# EAGLE design LPEM (EAGLE 6.5.0)

## Sheet 1 of 2
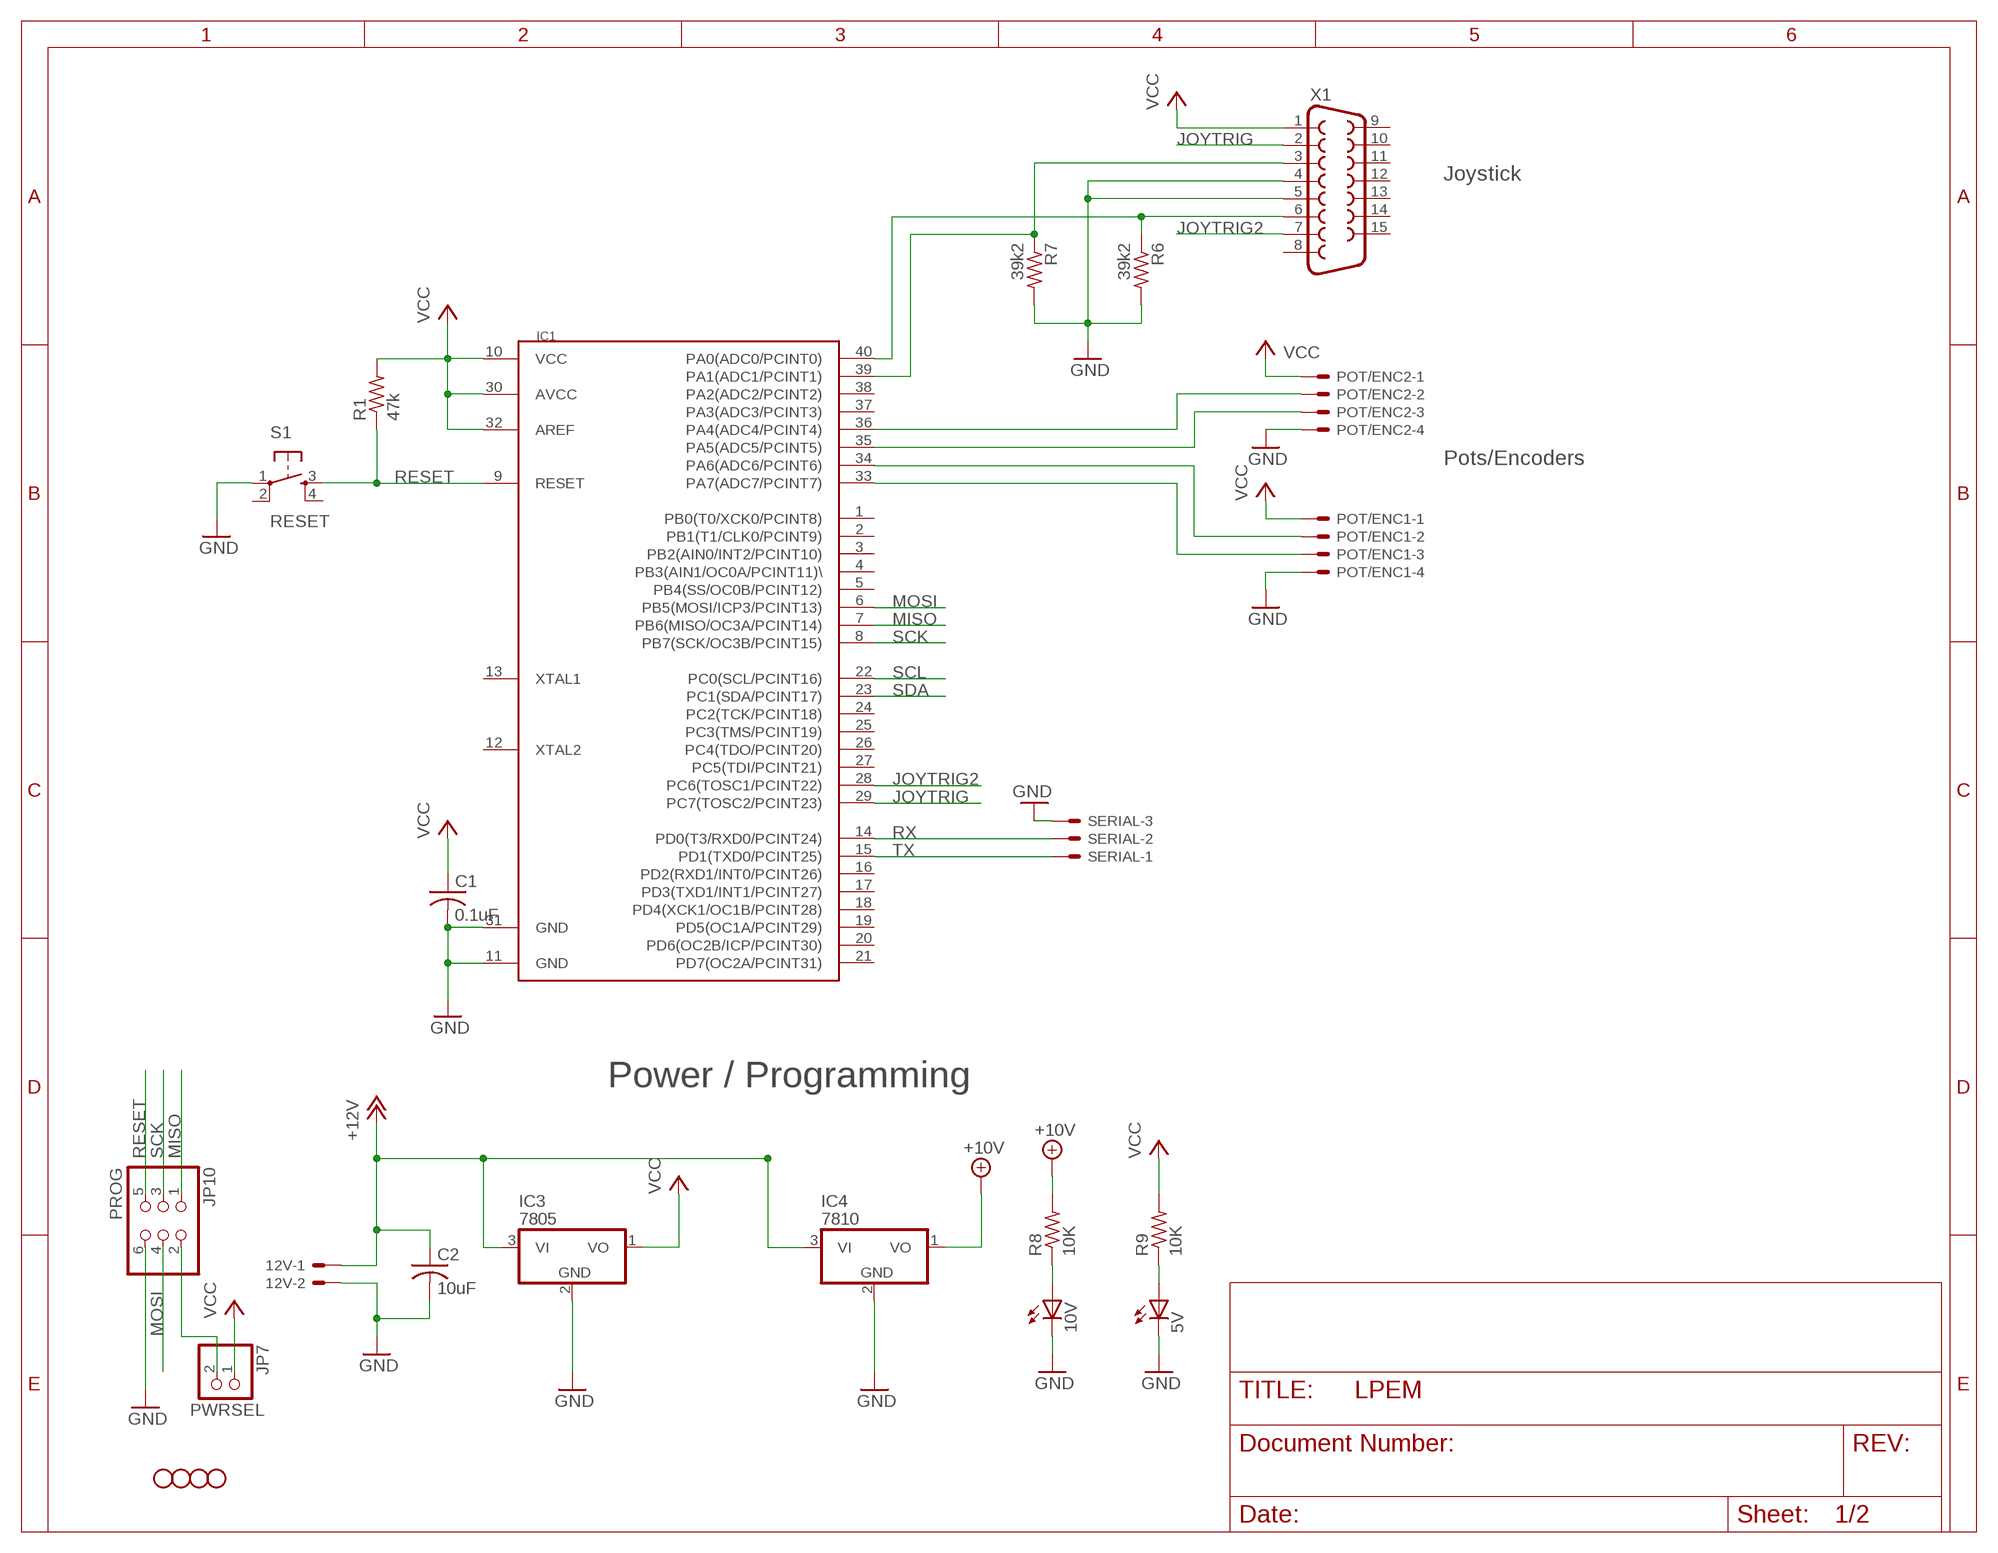
[diagram p0: schematic, sheet 1]

### Parts
5V  LED3MM  [LED3MM]
10V  LED3MM  [LED3MM]
12V  22-23-2021  [22-23-2021]
C1  0.1uF  C-US025-025X050  [C025-025X050]
C2  10uF  C-US025-025X050  [C025-025X050]
IC1  MEGA1284P  [DIL40]
IC3  7805  78L05Z  [TO92]
IC4  7810  78L05Z  [TO92]
JP1  STAND-OFF  [STAND-OFF]
JP2  STAND-OFF  [STAND-OFF]
JP7  PWRSEL  PINHD-1X2  [1X02]
JP8  STAND-OFF  [STAND-OFF]
JP9  STAND-OFF  [STAND-OFF]
JP10  PROG  PINHD-2X3  [2X03]
POT/ENC1  22-23-2041  [22-23-2041]
POT/ENC2  22-23-2041  [22-23-2041]
R1  47k  R-US_0204/5  [0204/5]
R6  39k2  R-US_0204/5  [0204/5]
R7  39k2  R-US_0204/5  [0204/5]
R8  10K  R-US_0204/5  [0204/5]
R9  10K  R-US_0204/5  [0204/5]
S1  RESET  TAC_SWITCHPTH  [TACTILE-PTH]
SERIAL  22-23-2031  [22-23-2031]
X1  F15HP  [F15HP]

### Nets
+10V [power]: IC4.1(VO) R8.2 ; also sheet 2
+12V [power]: 12V.1 C2.1 IC3.3(VI) IC4.3(VI) ; also sheet 2
GND [power]: 5V.K(C) 10V.K(C) 12V.2 C1.2 C2.2 IC1.11(GND) IC1.31(GND) IC3.2(GND) IC4.2(GND) JP10.6 POT/ENC1.4 POT/ENC2.4 R6.2 R7.2 S1.1 SERIAL.3 X1.4 X1.5 ; also sheet 2
JOYTRIG: IC1.29(PC7(TOSC2/PCINT23)) X1.2
JOYTRIG2: IC1.28(PC6(TOSC1/PCINT22)) X1.7
MISO: IC1.7(PB6(MISO/OC3A/PCINT14)) JP10.1
MOSI: IC1.6(PB5(MOSI/ICP3/PCINT13)) JP10.4
N$1: IC1.35(PA5(ADC5/PCINT5)) POT/ENC2.3
N$2: IC1.36(PA4(ADC4/PCINT4)) POT/ENC2.2
N$3: IC1.39(PA1(ADC1/PCINT1)) R7.1 X1.3
N$4: JP7.2 JP10.2
N$5: 5V.A R9.1
N$6: IC1.40(PA0(ADC0/PCINT0)) R6.1 X1.6
N$7: 10V.A R8.1
N$8: IC1.34(PA6(ADC6/PCINT6)) POT/ENC1.2
N$9: IC1.33(PA7(ADC7/PCINT7)) POT/ENC1.3
RESET: IC1.9(RESET) JP10.5 R1.1 S1.3
RX: IC1.14(PD0(T3/RXD0/PCINT24)) SERIAL.2
SCK: IC1.8(PB7(SCK/OC3B/PCINT15)) JP10.3
SCL: IC1.22(PC0(SCL/PCINT16)) ; also sheet 2
SDA: IC1.23(PC1(SDA/PCINT17)) ; also sheet 2
TX: IC1.15(PD1(TXD0/PCINT25)) SERIAL.1
VCC [power]: C1.1 IC1.10(VCC) IC1.30(AVCC) IC1.32(AREF) IC3.1(VO) JP7.1 POT/ENC1.1 POT/ENC2.1 R1.2 R9.2 X1.1 ; also sheet 2
Unconnected: IC1.1(PB0(T0/XCK0/PCINT8)) IC1.2(PB1(T1/CLK0/PCINT9)) IC1.3(PB2(AIN0/INT2/PCINT10)) IC1.4(PB3(AIN1/OC0A/PCINT11)\) IC1.5(PB4(SS/OC0B/PCINT12)) IC1.12(XTAL2) IC1.13(XTAL1) IC1.16(PD2(RXD1/INT0/PCINT26)) IC1.17(PD3(TXD1/INT1/PCINT27)) IC1.18(PD4(XCK1/OC1B/PCINT28)) IC1.19(PD5(OC1A/PCINT29)) IC1.20(PD6(OC2B/ICP/PCINT30)) IC1.21(PD7(OC2A/PCINT31)) IC1.24(PC2(TCK/PCINT18)) IC1.25(PC3(TMS/PCINT19)) IC1.26(PC4(TDO/PCINT20)) IC1.27(PC5(TDI/PCINT21)) IC1.37(PA3(ADC3/PCINT3)) IC1.38(PA2(ADC2/PCINT2)) S1.2 S1.4 X1.8 X1.9 X1.10 X1.11 X1.12 X1.13 X1.14 X1.15

### Notes on the sheet
- Joystick
- Pots/Encoders
- Power / Programming

## Sheet 2 of 2
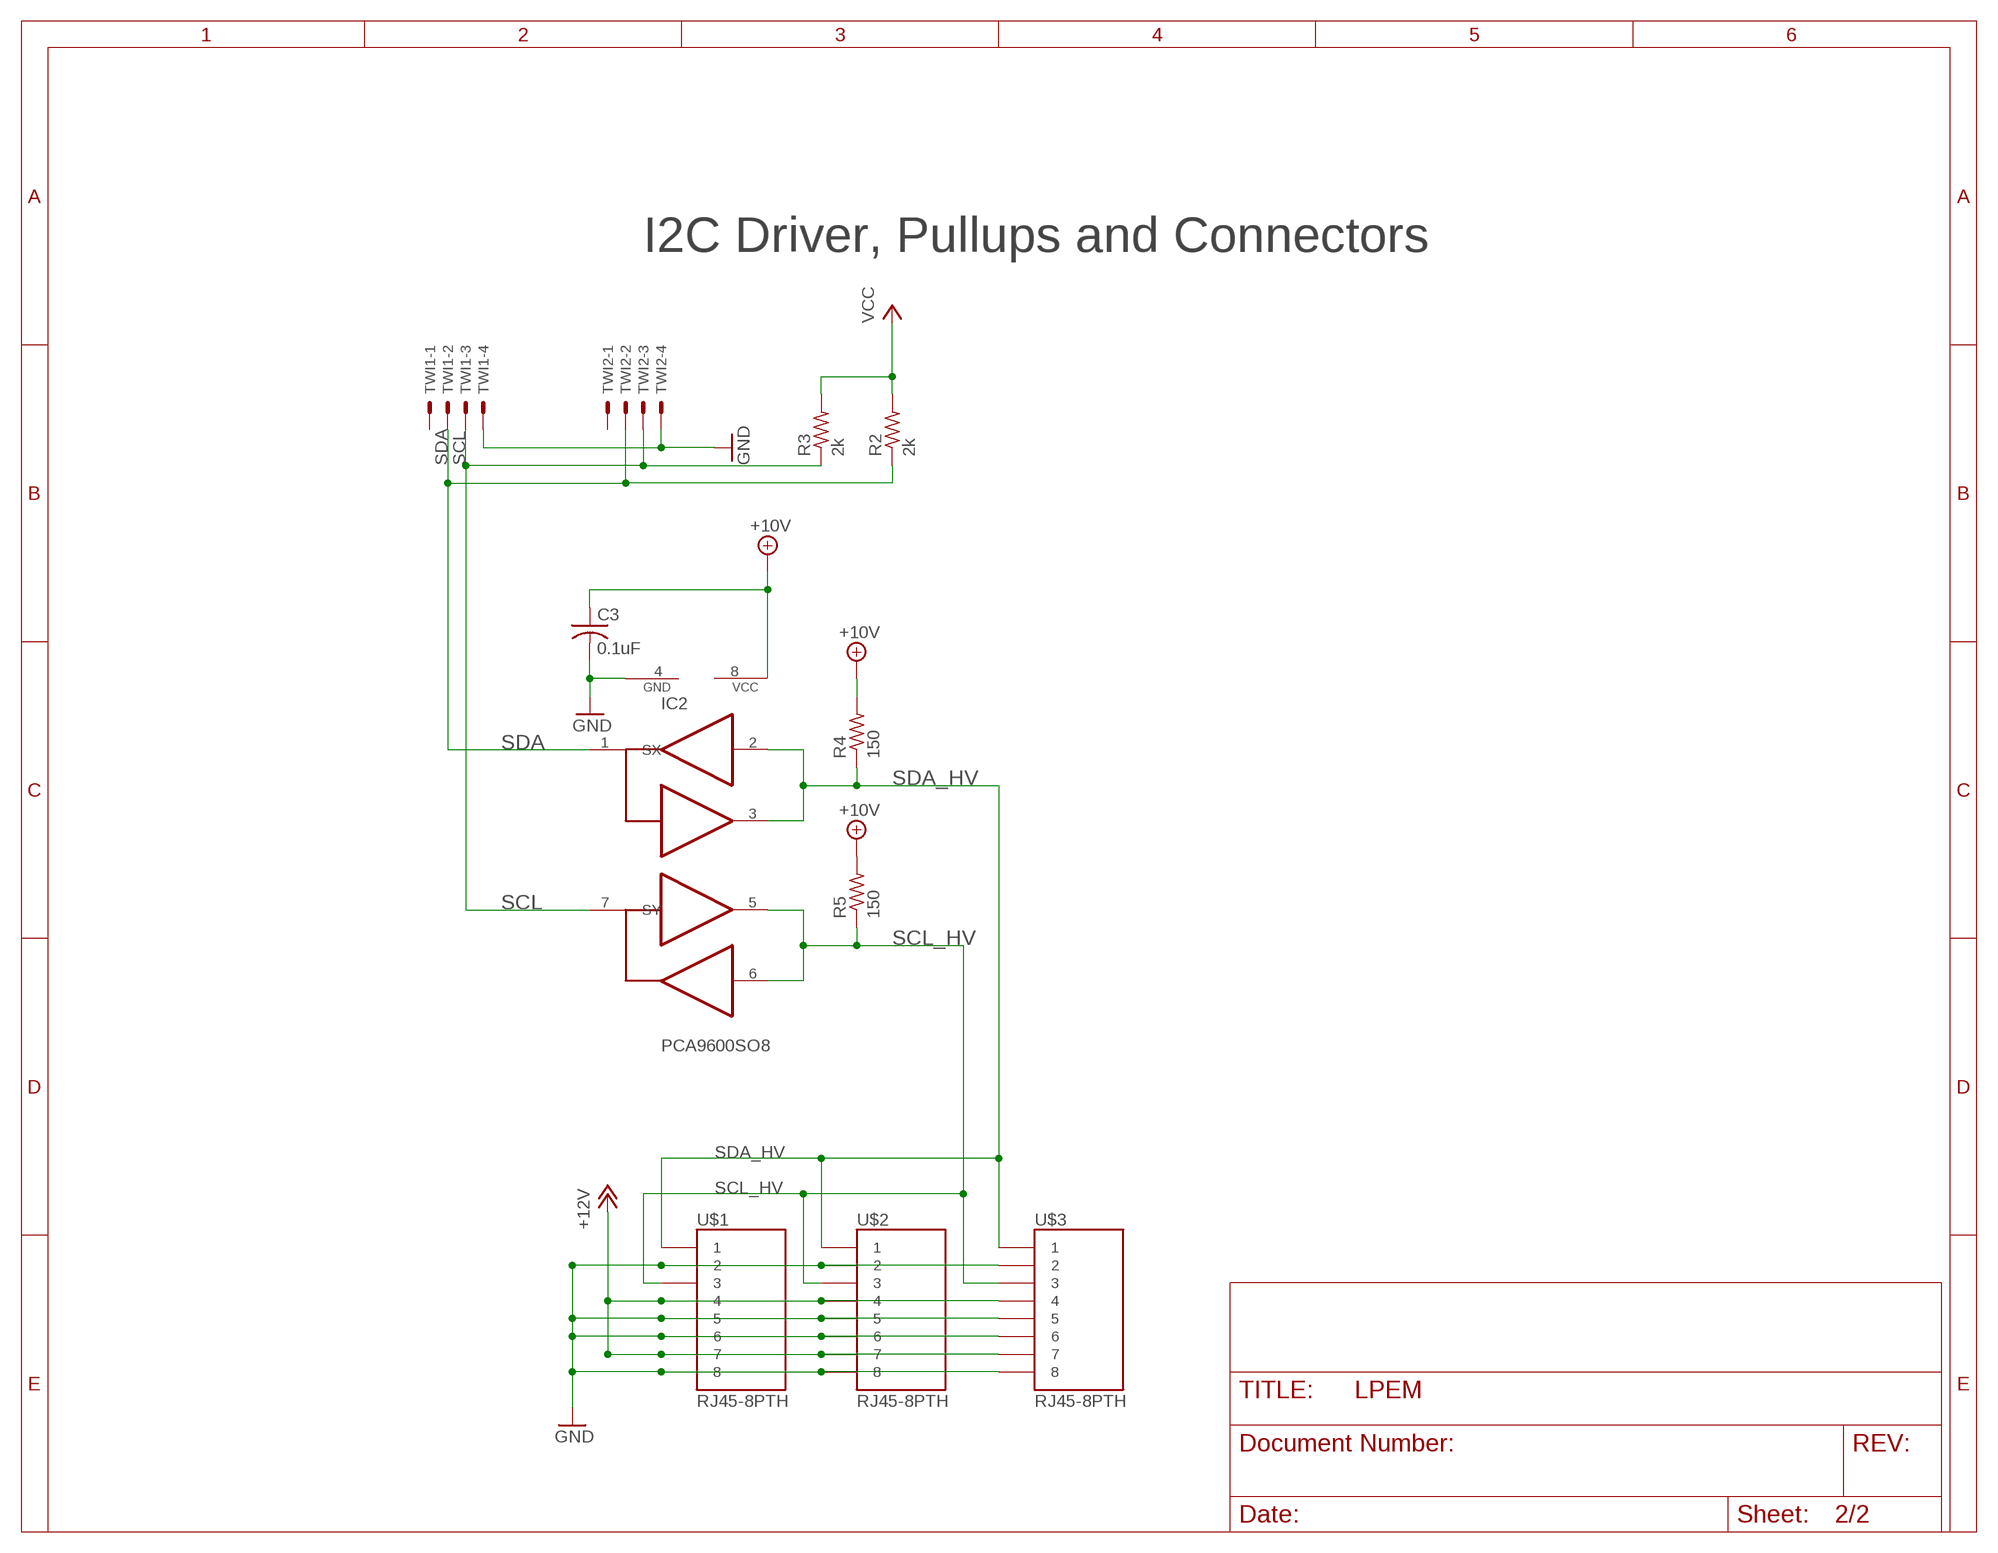
[diagram p1: schematic, sheet 2]

### Parts
C3  0.1uF  C-US025-025X050  [C025-025X050]
IC2  PCA9600SO8  [SO08]
R2  2k  R-US_0204/5  [0204/5]
R3  2k  R-US_0204/5  [0204/5]
R4  150  R-US_0204/5  [0204/5]
R5  150  R-US_0204/5  [0204/5]
TWI1  22-23-2041  [22-23-2041]
TWI2  22-23-2041  [22-23-2041]
U$1  RJ45-8PTH  [RJ45-8]
U$2  RJ45-8PTH  [RJ45-8]
U$3  RJ45-8PTH  [RJ45-8]

### Nets
+10V [power]: C3.1 IC2.8(VCC) R4.2 R5.2 ; also sheet 1
+12V [power]: U$1.4 U$1.7 U$2.4 U$2.7 U$3.4 U$3.7 ; also sheet 1
GND [power]: C3.2 IC2.4(GND) TWI1.4 TWI2.4 U$1.2 U$1.5 U$1.6 U$1.8 U$2.2 U$2.5 U$2.6 U$2.8 U$3.2 U$3.5 U$3.6 U$3.8 ; also sheet 1
SCL: IC2.7(SY) R3.1 TWI1.3 TWI2.3 ; also sheet 1
SCL_HV: IC2.5(TY) IC2.6(RY) R5.1 U$1.3 U$2.3 U$3.3
SDA: IC2.1(SX) R2.1 TWI1.2 TWI2.2 ; also sheet 1
SDA_HV: IC2.2(RX) IC2.3(TX) R4.1 U$1.1 U$2.1 U$3.1
VCC [power]: R2.2 R3.2 ; also sheet 1
Unconnected: TWI1.1 TWI2.1

### Notes on the sheet
- I2C Driver, Pullups and Connectors

## Library data of the parts
5V 10V = led:LED: LED OSRAM: - CHIPLED LG R971, LG N971, LY N971, LG Q971, LY Q971, LO R971, LY R971 LH N974, LH R974 LS Q976, LO Q976, LY Q976 LO Q996 - Hyper CHIPLED LW Q18S LB Q993, LB Q99A, LB R99A - SideLED LS A670, LO A670, LY A670, LG A670, LP A670 LB A673, LV A673, LT A673, LW A673 LH A674 LY A675 LS A676, LA A676, LO A676, LY A676, LW A676 LS A679, LY A679, LG A679 - Hyper Micro SIDELED® LS Y876, LA Y876, LO Y876, LY Y876 LT Y87S - SmartLED LW L88C, LW L88S LB L89C, LB L89S, LG L890 LS L89K, LO L89K, LY L89K LS L896, LA L896, LO L896, LY L896 - TOPLED LS T670, LO T670, LY T670, LG T670, LP T670 LSG T670, LSP T670, LSY T670, LOP T670, LYG T670 LG T671, LOG T671, LSG T671 LB T673, LV T673, LT T673, LW T673 LH T674 LS T676, LA T676, LO T676, LY T676, LB T676, LH T676, LSB T676, LW T676 LB T67C, LV T67C, LT T67C, LS T67K, LO T67K, LY T67K, LW E67C LS E67B, LA E67B, LO E67B, LY E67B, LB E67C, LV E67C, LT E67C LW T67C LS T679, LY T679, LG T679 LS T770, LO T770, LY T770, LG T770, LP T770 LB T773, LV T773, LT T773, LW T773 LH T774 LS E675, LA E675, LY E675, LS T675 LS T776, LA T776, LO T776, LY T776, LB T776 LHGB T686 LT T68C, LB T68C - Hyper Mini TOPLED® LB M676 - Mini TOPLED Santana® LG M470 LS M47K, LO M47K, LY M47K Source: http://www.osram.convergy.de LUXEON: - LUMILED® LXK2-PW12-R00, LXK2-PW12-S00, LXK2-PW14-U00, LXK2-PW14-V00 LXK2-PM12-R00, LXK2-PM12-S00, LXK2-PM14-U00 LXK2-PE12-Q00, LXK2-PE12-R00, LXK2-PE12-S00, LXK2-PE14-T00, LXK2-PE14-U00 LXK2-PB12-K00, LXK2-PB12-L00, LXK2-PB12-M00, LXK2-PB14-N00, LXK2-PB14-P00, LXK2-PB14-Q00 LXK2-PR12-L00, LXK2-PR12-M00, LXK2-PR14-Q00, LXK2-PR14-R00 LXK2-PD12-Q00, LXK2-PD12-R00, LXK2-PD12-S00 LXK2-PH12-R00, LXK2-PH12-S00 LXK2-PL12-P00, LXK2-PL12-Q00, LXK2-PL12-R00 Source: www.luxeon.com KINGBRIGHT: KA-3528ASYC Source: www.kingbright.com
12V = con-molex:22-23-2021: .100" (2.54mm) Center Header - 2 Pin; MF: MOLEX; MPN: 22-23-2021; OC_FARNELL: 1462926; OC_NEWARK: 25C3832
C1-C3 = rcl:C-US: CAPACITOR, American symbol
IC1 = 1284p:MEGA1284P: Atmel ATmega1284P 8-bit AVR Microcontroller
IC2 = 4534_I2C2:PCA9600: I2C ACTIVE TERMINATOR SO-8
IC3 IC4 = linear:78*: Positive VOLTAGE REGULATOR Source: http://cache.national.com/ds/LM/LM78L05.pdf http://www.fairchildsemi.com/ds/LM/LM7805.pdf
JP1 JP2 JP8 JP9 = SparkFun:STAND-OFF: Stand Off This is the mechanical footprint for a #4 phillips button head screw. Use the keepout ring to avoid running the screw head into surrounding components. SKU : PRT-00447
JP7 = pinhead:PINHD-1X2: PIN HEADER
JP10 = pinhead:PINHD-2X3: PIN HEADER
POT/ENC1 POT/ENC2 TWI1 TWI2 = con-molex:22-23-2041: .100" (2.54mm) Center Header - 4 Pin; MF: MOLEX; MPN: 22-23-2041; OC_FARNELL: 1462920; OC_NEWARK: 38C0355
R1-R9 = rcl:R-US_: RESISTOR, American symbol
S1 = SparkFun:TAC_SWITCH: Momentary Switch Button commonly used for reset or general input. Spark Fun Electronics SKU : COM-00097
SERIAL = con-molex:22-23-2031: .100" (2.54mm) Center Header - 3 Pin; MF: MOLEX; MPN: 22-23-2031; OC_FARNELL: 1462950; OC_NEWARK: 30C0862
U$1-U$3 = SparkFun:RJ45-8: RJ45 Jack Simple RJ45, 8-pin connection - connector for common Cat5, Cat5e, and Cat6 Ethernet cables. Footprint not yet proven in production. Connector sku is PRT-00643; Breakout PCB sku is BOB-00716.
X1 = con-subd:F15: SUB-D

## Net classes
0 default: width 0.152 mm, drill 0.152 mm, clearance 0.152 mm
1 power: width 0.305 mm, drill 0.305 mm, clearance 0.152 mm to class 0, clearance 0.152 mm

## Board
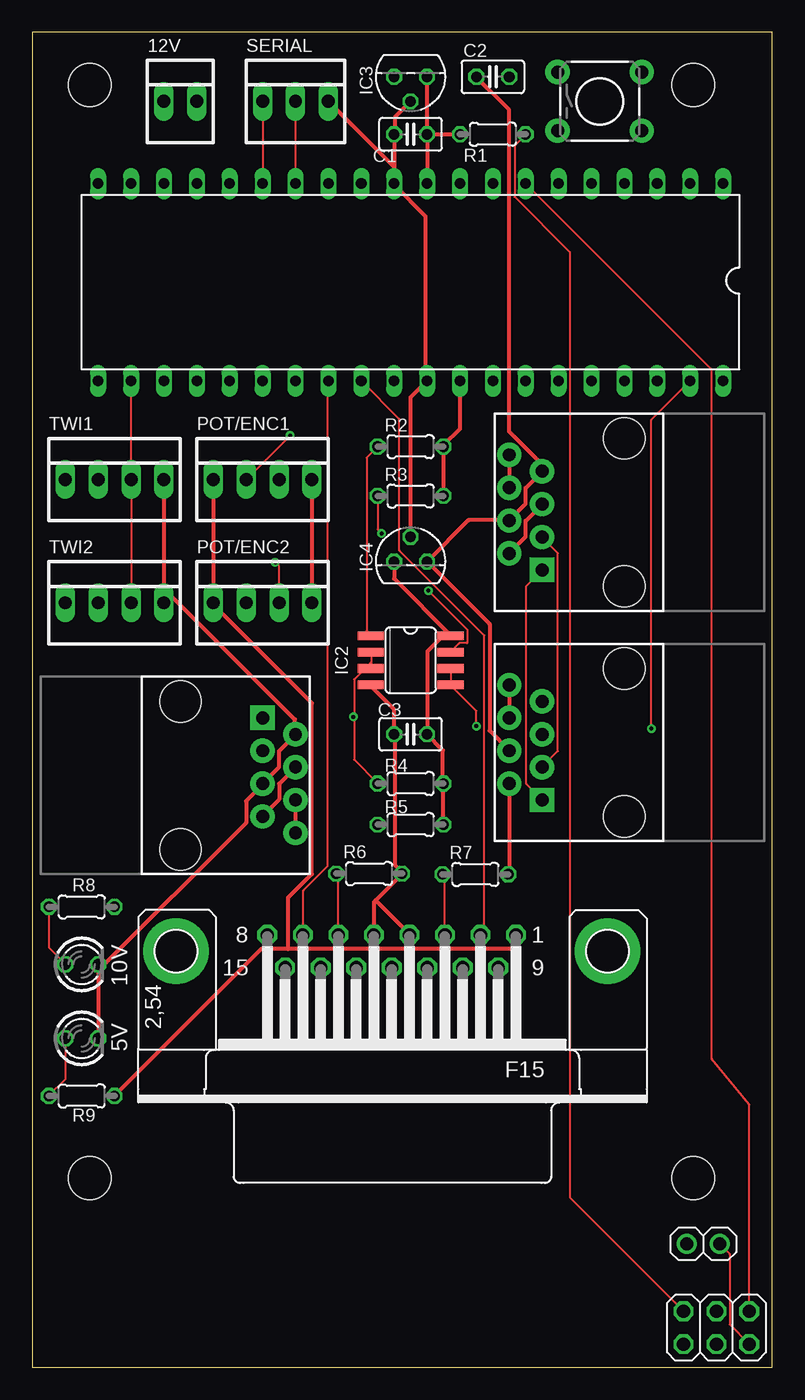
[diagram p2: board, top side]
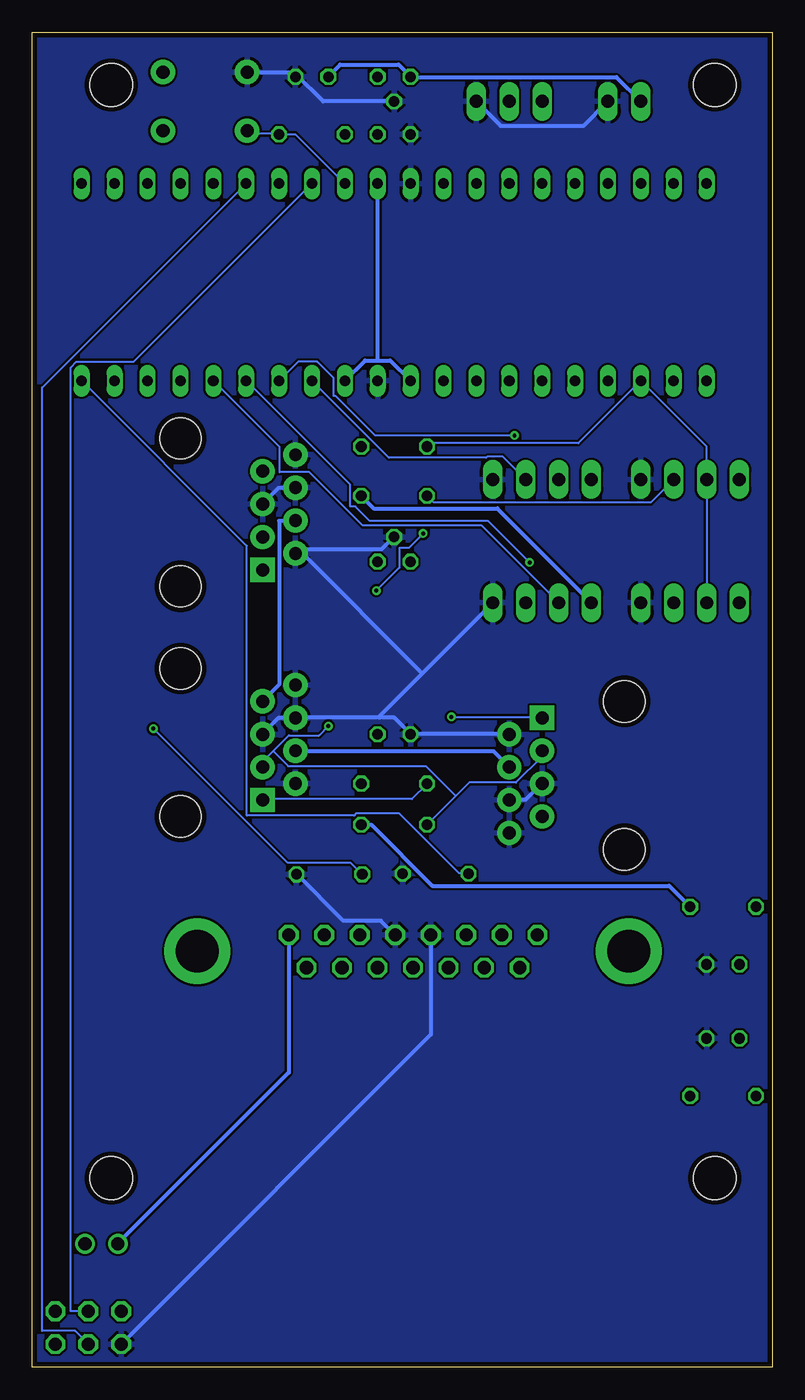
[diagram p3: board, bottom side, seen from below]

Size 57.15 x 103.12 mm. Coordinates in mm from the lower left corner, seen from the top.
Outline: 0,0 57.15,0 57.15,103.12 0,103.12 0,0
Copper layers (1*16): Top 0.0356mm / dielectric 1.5011mm / Bottom 0.0356mm
Design rules "DorkbotPDX *": minimum track width 6mil, minimum drill 12mil, track to track 7mil, track to pad 7mil, pad to pad 7mil, via to via 7mil, smd to smd 6mil, copper to edge 15mil, drill to drill 15mil, minimum pad ring 7mil, minimum via ring 7mil, stop-mask expansion 4mil, vias tented up to drill 13mil, thermal gap 10mil
tRestrict: area -1.3,100.6 to 6.3,104.4; area -1,96.8 to 2.3,100.6

### Footprints (pad centres in the part's own frame; a part is rotated, then mirrored left to right if it is on the bottom)
LED3MM = drill 0.813 octagon: A -1.27,0; K 1.27,0
22-23-2021 = drill 1 long: 1 -1.27,0; 2 1.27,0
C025-025X050 = drill 0.813 octagon: 1 -1.27,0; 2 1.27,0
DIL40 = drill 0.813 long: 1 -24.13,-7.62; 2 -21.59,-7.62; 3 -19.05,-7.62; 4 -16.51,-7.62; 5 -13.97,-7.62; 6 -11.43,-7.62; 7 -8.89,-7.62; 8 -6.35,-7.62; 9 -3.81,-7.62; 10 -1.27,-7.62; 11 1.27,-7.62; 12 3.81,-7.62; 13 6.35,-7.62; 14 8.89,-7.62; 15 11.43,-7.62; 16 13.97,-7.62; 17 16.51,-7.62; 18 19.05,-7.62; 19 21.59,-7.62; 20 24.13,-7.62; 21 24.13,7.62; 22 21.59,7.62; 23 19.05,7.62; 24 16.51,7.62; 25 13.97,7.62; 26 11.43,7.62; 27 8.89,7.62; 28 6.35,7.62; 29 3.81,7.62; 30 1.27,7.62; 31 -1.27,7.62; 32 -3.81,7.62; 33 -6.35,7.62; 34 -8.89,7.62; 35 -11.43,7.62; 36 -13.97,7.62; 37 -16.51,7.62; 38 -19.05,7.62; 39 -21.59,7.62; 40 -24.13,7.62
SO08 = smd 0.66 x 2.032: 1 -1.905,-3.073; 2 -0.635,-3.073; 3 0.635,-3.073; 4 1.905,-3.073; 5 1.905,3.073; 6 0.635,3.073; 7 -0.635,3.073; 8 -1.905,3.073
TO92 = drill 0.813 octagon: 1 -1.27,0; 2 0,1.905; 3 1.27,0
STAND-OFF = hole 3.302: 0,0
1X02 = drill 1.016: 1 -1.27,0; 2 1.27,0
2X03 = drill 1.016 octagon: 1 -2.54,-1.27; 2 -2.54,1.27; 3 0,-1.27; 4 0,1.27; 5 2.54,-1.27; 6 2.54,1.27
22-23-2041 = drill 1 long: 1 -3.81,0; 2 -1.27,0; 3 1.27,0; 4 3.81,0
0204/5 = drill 0.813 octagon: 1 -2.54,0; 2 2.54,0
TACTILE-PTH = drill 1.016 pad 1.88: 1 -3.251,2.261; 2 3.251,2.261; 3 -3.251,-2.261; 4 3.251,-2.261
22-23-2031 = drill 1 long: 1 -2.54,0; 2 0,0; 3 2.54,0
RJ45-8 = drill 1 pad 1.88 square: 1 -4.445,6.35 | drill 1 pad 1.88: 2 -3.175,8.89; 3 -1.905,6.35; 4 -0.635,8.89; 5 0.635,6.35; 6 1.905,8.89; 7 3.175,6.35; 8 4.445,8.89 | hole 3.2: -5.715,0; 5.715,0
F15HP = drill 1.016 octagon: 1 -9.601,-1.27; 2 -6.858,-1.27; 3 -4.115,-1.27; 4 -1.372,-1.27; 5 1.372,-1.27; 6 4.115,-1.27; 7 6.858,-1.27; 8 9.601,-1.27; 9 -8.23,1.27; 10 -5.486,1.27; 11 -2.743,1.27; 12 0,1.27; 13 2.743,1.27; 14 5.486,1.27; 15 8.23,1.27 | drill 3.302 pad 5.08: G1 -16.662,0; G2 16.662,0

### Placement (x,y rotation side)
5V  3.81,25.4 0 top
10V  3.81,31.11 0 top
12V  11.43,97.79 0 top
C1  29.21,95.25 180 top
C2  35.56,99.69 0 top
C3  29.21,48.89 180 top
IC1  29.21,83.82 180 top
IC2  29.21,54.61 270 top
IC3  29.21,99.69 180 top
IC4  29.21,62.23 0 top
JP1  4.45,99.06 0 top
JP2  51.05,99.06 0 top
JP7  51.82,9.53 0 top
JP8  4.45,14.61 0 top
JP9  51.05,14.61 0 top
JP10  52.83,3.05 180 top
POT/ENC1  17.78,68.58 0 top
POT/ENC2  17.78,59.06 0 top
R1  35.56,95.25 180 top
R2  29.21,71.12 0 top
R3  29.21,67.31 0 top
R4  29.21,45.08 0 top
R5  29.21,41.91 0 top
R6  26.01,38.13 0 top
R7  34.21,38.07 0 top
R8  3.81,35.56 0 top
R9  3.81,20.95 0 top
S1  43.81,97.79 0 top
SERIAL  20.32,97.79 0 top
TWI1  6.35,68.58 0 top
TWI2  6.35,59.06 0 top
U$1  45.72,48.26 90 top
U$2  45.72,66.04 90 top
U$3  11.43,45.72 270 top
X1  27.75,32.13 180 top

### Tracks (layer width: path | path; a pad name or v marks a point on that pad's centre or on a via)
+10V
  Top 0.305: IC4.1 27.94,60.91 32.31,56.54 IC2.8 31.95,56.74 30.53,55.32 30.53,49.02 C3.1 30.48,48.87 31.7,47.65 31.7,45.21 R4.2 R5.2
  Bottom 0.305: R8.2 7.98,37.19 26.26,37.19 30.99,41.91 R5.2
+12V
  Top 0.305: U$3.7 17.78,42.57 19.05,43.84 19.05,45.06 20.32,46.33 U$3.4 | U$1.4 36.83,47.65 35.31,49.17 35.31,57.4 IC4.3 33.68,65.43 36.83,65.43 U$2.4 36.93,65.53 38.1,66.7 38.1,67.92 39.37,69.19 U$2.7 39.32,69.34 39.32,69.8 36.83,72.29 36.83,97.13 34.29,99.67 C2.1
  Bottom 0.305: C2.1 34.29,99.72 33.38,100.63 28.85,100.63 27.94,99.72 IC3.3 27.84,99.67 12.04,99.67 12V.1 | U$1.7 39.37,51.46 38.1,52.73 38.1,65.38 36.83,65.38 U$2.4 | U$3.4 20.32,46.38 21.54,47.6 36.83,47.6 U$1.4
GND
  Top 0.305: R7.2 36.83,38.15 U$1.2 | 26.52,36.07 26.42,35.97 26.42,33.43 X1.5 | 26.52,36.07 28.55,38.1 R6.2 28.55,38.25 27.99,38.81 27.99,48.77 C3.2 27.94,50.8 26.16,52.58 IC2.4 26.16,52.73 | 26.52,36.07 29.16,33.43 X1.4 | 27.94,92.81 C1.2 28.04,95.35 28.04,96.62 IC3.2 | 27.94,92.81 IC1.11 27.94,91.34 30.38,88.9 30.38,76.3 IC1.31 29.21,74.93 IC4.2 | SERIAL.3 27.84,92.81 27.94,92.81 | U$2.8 U$2.6 | U$2.5 39.37,66.65 38.1,65.38 38.1,64.16 36.83,62.89 U$2.2 | POT/ENC1.4 POT/ENC2.4 | TWI1.4 TWI2.4 10.26,60.05 20.27,50.04 20.27,49.02 U$3.2 20.32,48.87 19.05,47.6 19.05,46.38 17.78,45.11 U$3.5 17.73,44.96 16.51,43.74 16.51,42.06 5.18,30.73 10V.K 5V.K | U$1.8 U$1.6 | U$3.6 U$3.8
  Bottom 0.305: JP10.6 26.36,25.7 26.36,33.38 X1.5 | R7.2 36.73,38.1 33.12,34.49 30.23,34.49 29.16,33.43 X1.4 | 12V.2 14.58,95.91 20.98,95.91 SERIAL.3 | S1.1 40.54,100.02 37.13,100.02 36.83,99.72 C2.2 36.73,99.82 34.7,97.79 IC3.2 | U$2.5 39.37,66.7 38.15,67.92 36.83,67.92 U$2.6 | IC4.2 29.21,64.16 30.18,63.19 36.52,63.19 36.83,62.89 U$2.2 36.47,63.04 27.03,53.59 | U$1.5 39.37,48.92 38.15,50.14 36.83,50.14 U$1.6 36.73,50.14 36.68,50.19 30.33,50.19 | U$3.5 17.78,45.11 19.05,43.84 20.32,43.84 U$3.6 | U$3.2 20.32,48.92 27.94,48.92 C3.2 28.04,49.02 29.21,50.19 30.33,50.19 | 27.03,53.59 30.33,50.29 30.33,50.19 | 27.03,53.59 21.59,59.03 POT/ENC2.4
  pour Bottom: 0,104.14 59.05,104.14 58.42,-0.63 0,-0.63
JOYTRIG
  Top 0.152: IC1.29 28.35,73.25 28.35,63.09 34.9,56.54 34.9,33.68 34.65,33.43 X1.2
JOYTRIG2
  Top 0.152: IC1.28 22.81,76.15 22.81,38.71 20.93,36.83 20.93,33.43 X1.7
MISO
  Top 0.152: IC1.7 52.48,77.06 52.48,23.82 55.37,20.3 JP10.1
MOSI
  Bottom 0.152: IC1.6 56.39,75.69 56.39,2.79 53.85,2.79 JP10.4
N$1  (via drill 0.3)
  Top 0.152: v18.75,62.18 19.05,61.87 POT/ENC2.3
  Bottom 0.152: IC1.35 32.61,68.17 32.61,66.5 32.21,66.5 31.09,65.38 21.95,65.38 v18.75,62.18
N$2
  Bottom 0.152: IC1.36 38.05,71.07 38.05,69.14 35.76,69.14 31.65,65.02 22.45,65.02 16.51,59.08 POT/ENC2.2
N$3  (via drill 0.3)
  Top 0.152: R7.1 31.85,37.9 31.85,33.43 X1.3 | IC1.39 47.8,73.2 v47.8,49.33
  Bottom 0.152: v47.8,49.33 37.44,38.96 32.56,38.96 R7.1
N$4
  Top 0.152: JP10.2 53.85,3.3 53.85,8.74 53.09,9.5 JP7.2
N$5
  Top 0.152: 5V.A 2.54,22.25 1.27,20.98 R9.1
N$6
  Top 0.152: R6.1 23.47,38.1 23.62,37.95 23.62,33.43 X1.6
  Bottom 0.152: IC1.40 40.59,63.45 40.59,42.62 32.31,42.62 32.16,42.77 28.8,42.77 24.18,38.15 23.47,38.15 R6.1
N$7
  Top 0.152: R8.1 1.27,32.41 2.54,31.14 10V.A
N$8  (via drill 0.3)
  Top 0.152: POT/ENC1.2 v19.91,71.98
  Bottom 0.152: IC1.34 36.63,77.67 35.15,77.67 33.88,76.4 33.88,75.03 33.73,75.03 30.68,71.98 v19.91,71.98
N$9
  Bottom 0.152: IC1.33 29.62,70.26 22.1,70.26 22,70.36 20.83,70.36 POT/ENC1.3
RESET
  Top 0.152: JP10.5 41.5,13.11 41.5,86.16 37.24,90.42 37.24,94.39 R1.1
  Bottom 0.152: IC1.9 36.83,95.25 R1.1 38.15,95.3 40.28,95.3 40.54,95.55 S1.3
RX
  Top 0.152: SERIAL.2 IC1.14
SCK
  Bottom 0.152: IC1.8 49.33,77.67 53.75,77.67 54.2,77.22 54.2,4.32 JP10.3
SCL  (via drill 0.3)
  Top 0.152: IC2.7 32.97,55.93 33.58,55.93 33.58,57 v30.58,60 | v26.98,64.41 26.67,64.72 R3.1 | IC1.22 TWI1.3 TWI2.3
  Bottom 0.152: v30.58,60 28.8,61.77 28.8,63.3 28.09,63.3 v26.98,64.41 | R3.1 26.16,66.8 9.4,66.8 TWI1.3
SCL_HV  (via drill 0.3)
  Top 0.152: IC2.6 32.31,53.95 32.31,52.73 IC2.5 34.29,50.7 v34.29,49.53 | U$2.3 39.37,64.11 40.59,62.89 40.59,47.6 39.37,46.38 U$1.3
  Bottom 0.152: 24.46,44.12 23.42,45.16 19.81,45.16 17.78,47.19 U$3.3 | 24.46,44.12 R5.1 | v34.29,49.53 35,48.82 37.34,48.82 38.56,47.6 | 38.56,47.6 39.37,46.79 U$1.3 | 24.46,44.12 26.77,46.43 37.39,46.43 38.56,47.6
SDA
  Top 0.152: R2.1 25.81,70.26 25.81,56.9 26.16,56.54 IC2.1
  Bottom 0.152: TWI2.2 TWI1.2 5.08,71.12 IC1.23 14.99,71.37 26.42,71.37 R2.1
SDA_HV  (via drill 0.3)
  Top 0.152: 26.16,54.41 26.16,55.22 IC2.2 | 26.16,54.41 26.16,54 IC2.3 | 24.84,50.24 24.84,53.14 26.11,54.41 26.16,54.41 | 24.84,50.24 24.84,46.94 26.67,45.11 R4.1 | v24.79,50.24 24.84,50.24 | U$2.1 39.37,61.57 38.15,60.35 38.15,45.06 39.37,43.84 U$1.1
  Bottom 0.152: v24.79,50.24 17.83,50.24 17.78,50.19 U$3.1 | U$1.1 39.37,43.84 39.32,43.89 27.84,43.89 26.67,45.06 R4.1
TX
  Top 0.152: SERIAL.1 IC1.15
VCC
  Top 0.305: POT/ENC1.1 POT/ENC2.1 13.97,58.93 21.59,51.31 21.59,38.1 19.76,36.27 19.76,32.31 | C1.1 IC1.10 | C1.1 R1.2 | C1.1 IC3.1 | R3.2 R2.2 31.75,71.22 33.02,72.49 IC1.32 | 19.76,32.31 37.34,32.31 37.34,33.38 X1.1 | 19.76,32.31 17.68,32.31 6.35,20.98 R9.2
  Bottom 0.305: IC1.30 29.52,77.77 30.48,77.77 | 30.48,77.77 31.45,77.77 IC1.32 | 30.48,77.77 IC1.10 | R3.2 30.79,66.34 21.23,66.34 13.97,59.08 POT/ENC2.1 | JP7.1 50.55,9.55 37.34,22.76 37.34,33.38 X1.1

### Text on the board
tNames: 10V | 5V
tDocu: RESET | 5V | GND | TX | RX | GND | LPEM v2.1 Oct '17 | 1